# EAGLE design angularclock (EAGLE 6.5.0)
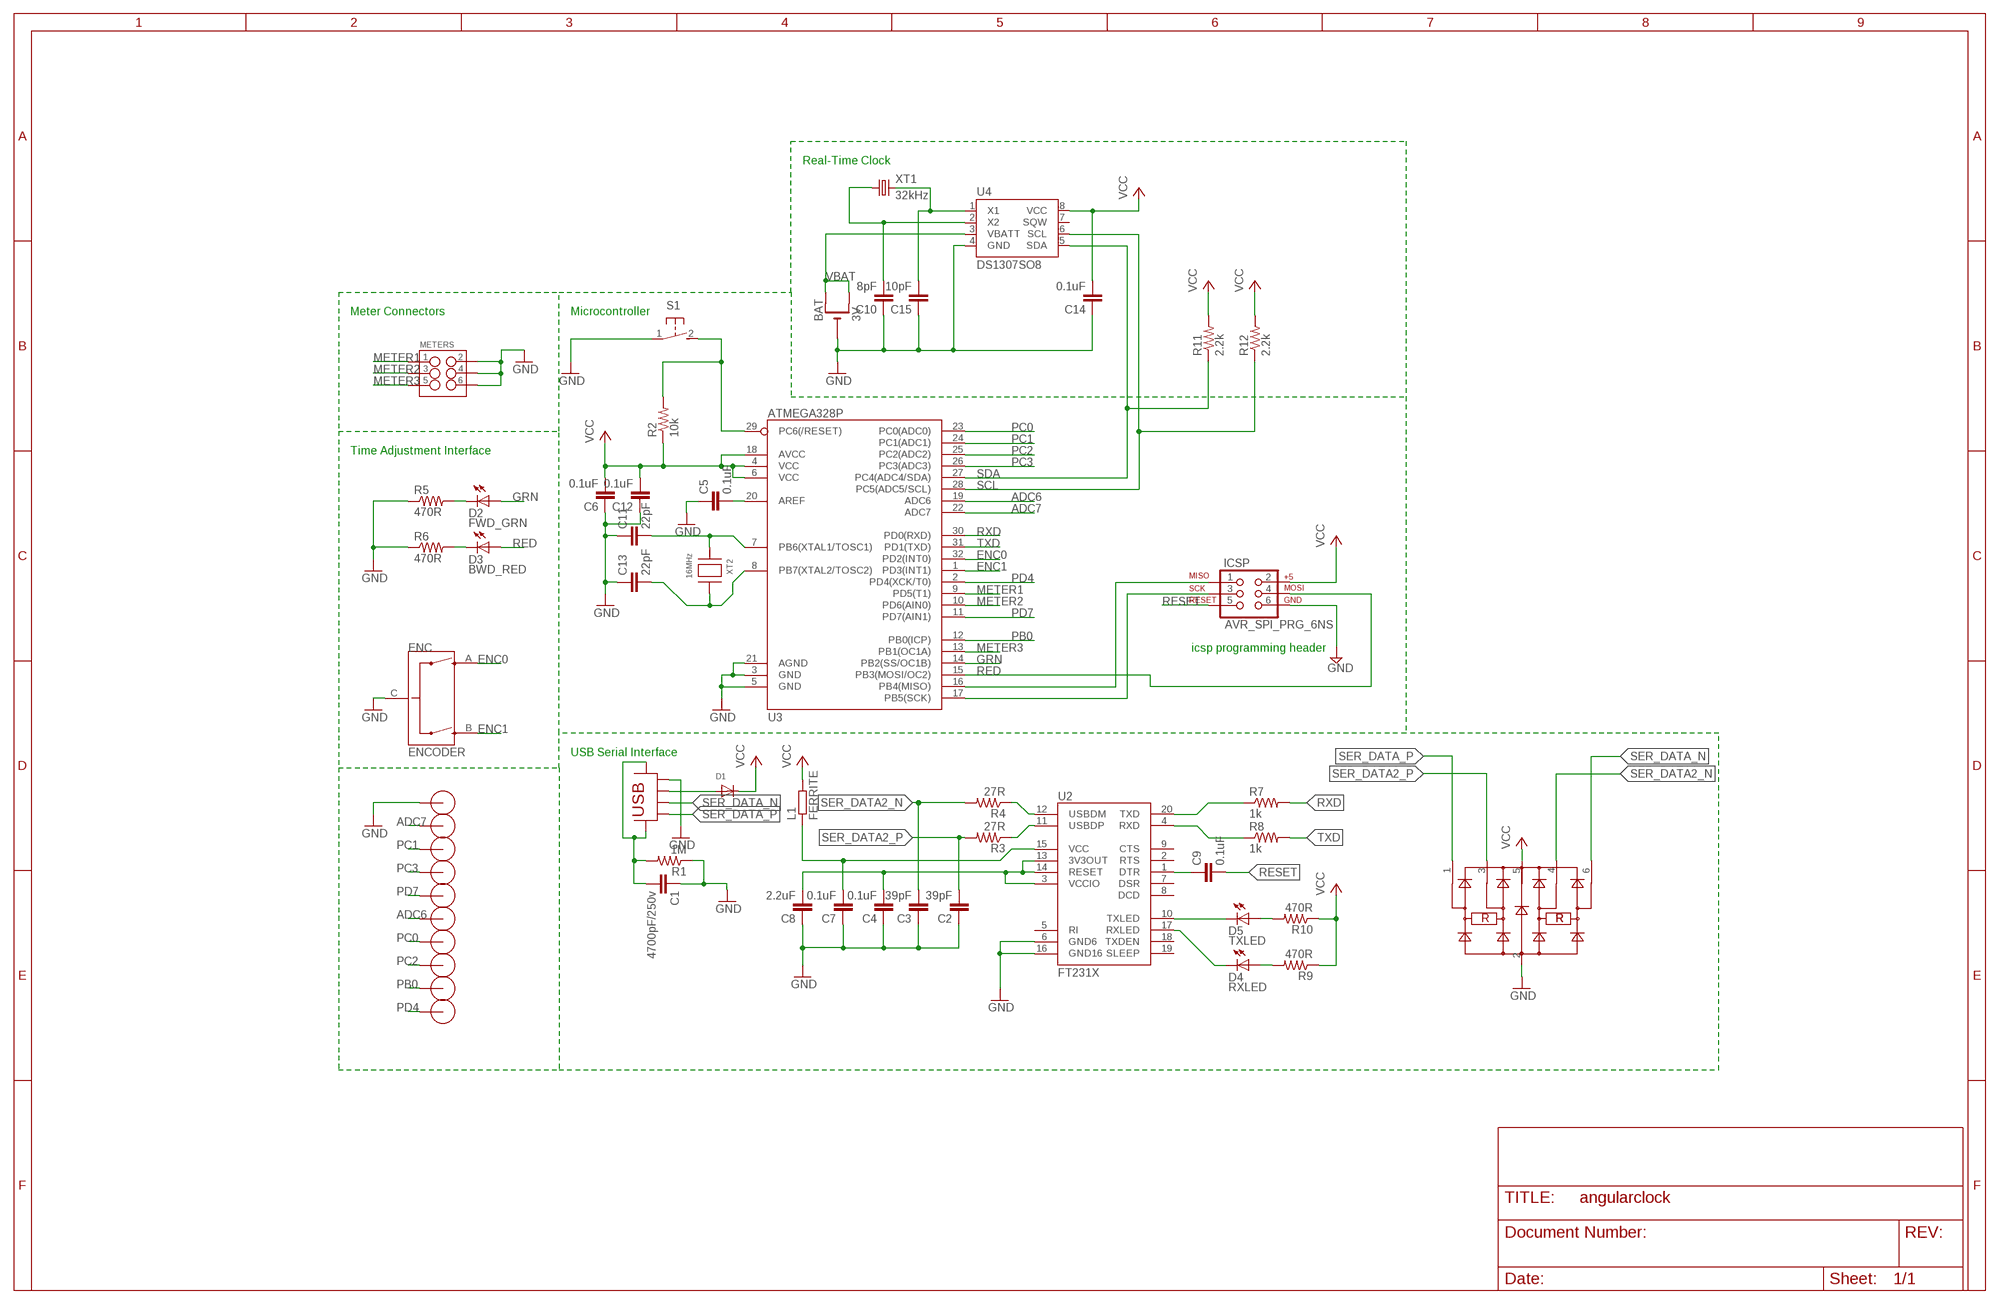
[diagram p0: schematic, sheet 1]

## Parts
BAT  3V  CR1220THM  [CR1220-THM]
C1  4700pF/250v  CAP0805  [0805]
C2  39pF  CAP0805  [0805]
C3  39pF  CAP0805  [0805]
C4  0.1uF  CAP0805  [0805]
C5  0.1uF  CAP0805  [0805]
C6  0.1uF  CAP0805  [0805]
C7  0.1uF  CAP0805  [0805]
C8  2.2uF  CAP0805  [0805]
C9  0.1uF  CAP0805  [0805]
C10  8pF  CAP0805  [0805]
C11  22pF  CAP0805  [0805]
C12  0.1uF  CAP0805  [0805]
C13  22pF  CAP0805  [0805]
C14  0.1uF  CAP0805  [0805]
C15  10pF  CAP0805  [0805]
D1  MBRM130LT1G  [DO-216AA]
D2  FWD_GRN  LEDCHIPLED_0805  [CHIPLED_0805]
D3  BWD_RED  LEDCHIPLED_0805  [CHIPLED_0805]
D4  RXLED  LEDCHIPLED_0805  [CHIPLED_0805]
D5  TXLED  LEDCHIPLED_0805  [CHIPLED_0805]
ENC  ENCODER  ENCODER-QUADRATURE  [ENCODER-16MM-QUAD]
ICSP  AVR_SPI_PRG_6NS  [2X3-NS]
L1  FERRITE  R-EU_R0805  [R0805]
METERS  M03X2NO_SILK  [2X3-NS]
R1  1M  RESISTOR0805-RES  [0805]
R2  10k  RESISTOR0805-RES  [0805]
R3  27R  RESISTOR0805-RES  [0805]
R4  27R  RESISTOR0805-RES  [0805]
R5  470R  RESISTOR0805-RES  [0805]
R6  470R  RESISTOR0805-RES  [0805]
R7  1k  RESISTOR0805-RES  [0805]
R8  1k  RESISTOR0805-RES  [0805]
R9  470R  RESISTOR0805-RES  [0805]
R10  470R  RESISTOR0805-RES  [0805]
R11  2.2k  RESISTOR0805-RES  [0805]
R12  2.2k  RESISTOR0805-RES  [0805]
S1  31-XX  [B3F-31XX]
U1  IP4234CZ6  [SOT457]
U2  FT231X  [SSOP20]
U3  ATMEGA328P  ATMEGA328_SMT  [TQFP32-08]
U4  DS1307SO8  [SO08]
U$1  1PIN  [1PIN]
U$2  1PIN  [1PIN]
U$3  1PIN  [1PIN]
U$4  1PIN  [1PIN]
U$5  1PIN  [1PIN]
U$6  1PIN  [1PIN]
U$7  1PIN  [1PIN]
U$8  1PIN  [1PIN]
U$9  1PIN  [1PIN]
U$10  1PIN  [1PIN]
USB  MICRO-USB-POWERMICRO-USB-2-ROUND-HOLES  WICKED-DEVICE_MICRO-USB-POWERMICRO-USB-4  [WICKED-DEVICE_MICRO-USB-4]
XT1  32kHz  CRYSTAL_CRYSTALTC26V  [CRYSTAL_TC26V]
XT2  16MHz  ABLS  [ABLS]

## Nets
ADC6: U3.19(ADC6) U$1.1
ADC7: U3.22(ADC7) U$4.1
ENC0: ENC.A U3.32(PD2(INT0))
ENC1: ENC.B U3.1(PD3(INT1))
FT33: C4.2 C8.2 U2.3(VCCIO) U2.13(3V3OUT) U2.14(RESET)
FTDI_VCC: C7.2 L1.1 U2.15(VCC)
GND: BAT.- C1.1 C2.1 C3.1 C4.1 C5.1 C6.1 C7.1 C8.1 C10.1 C11.1 C12.1 C13.1 C14.1 C15.1 ENC.C ICSP.6 METERS.2 METERS.4 METERS.6 R1.1 R5.1 R6.1 S1.1(P) U1.2 U2.6(GND6) U2.16(GND16) U3.3(GND) U3.5(GND) U3.21(AGND) U4.4(GND) U$2.1 USB.GND
GRN: D2.A U3.14(PB2(SS/OC1B))
METER1: METERS.1 U3.9(PD5(T1))
METER2: METERS.3 U3.10(PD6(AIN0))
METER3: METERS.5 U3.13(PB1(OC1A))
MISO: ICSP.1 U3.16(PB4(MISO))
N$1: C11.2 U3.7(PB6(XTAL1/TOSC1)) XT2.1
N$2: C5.2 U3.20(AREF)
N$3: D2.C R5.2
N$4: C13.2 U3.8(PB7(XTAL2/TOSC2)) XT2.2
N$5: D3.C R6.2
N$6: R7.1 U2.20(TXD)
N$7: C1.2 R1.2 USB.P$2 USB.P$3
N$8: C15.2 U4.1(X1) XT1.2
N$9: C10.2 U4.2(X2) XT1.1
N$21: R8.1 U2.4(RXD)
N$25: D5.C U2.10(TXLED)
N$26: D4.C U2.17(RXLED)
N$27: D5.A R10.2
N$28: D4.A R9.2
N$30: C9.1 U2.1(DTR)
PB0: U3.12(PB0(ICP)) U$5.1
PC0: U3.23(PC0(ADC0)) U$3.1
PC1: U3.24(PC1(ADC1)) U$6.1
PC2: U3.25(PC2(ADC2)) U$7.1
PC3: U3.26(PC3(ADC3)) U$10.1
PD4: U3.2(PD4(XCK/T0)) U$9.1
PD7: U3.11(PD7(AIN1)) U$8.1
RED: D3.A ICSP.4 U3.15(PB3(MOSI/OC2))
RESET: C9.2 ICSP.5 R2.2 S1.2(S) U3.29(PC6(/RESET))
RXD: R7.2 U3.30(PD0(RXD))
SCK: ICSP.3 U3.17(PB5(SCK))
SCL: R12.1 U3.28(PC5(ADC5/SCL)) U4.6(SCL)
SDA: R11.1 U3.27(PC4(ADC4/SDA)) U4.5(SDA)
SER_DATA2_N [differential_100ohm]: C3.2 R4.2 U1.4
SER_DATA2_P [differential_100ohm]: C2.2 R3.2 U1.3
SER_DATA_N [differential_100ohm]: U1.6 USB.D-
SER_DATA_P [differential_100ohm]: U1.1 USB.D+
TXD: R8.2 U3.31(PD1(TXD))
USB_N [differential_100ohm]: R4.1 U2.12(USBDM)
USB_P [differential_100ohm]: R3.1 U2.11(USBDP)
USB_VCC: D1.+ USB.VBUS
VBAT: BAT.+1(+) BAT.+2(+1) U4.3(VBATT)
VCC: C6.2 C12.2 C14.2 D1.- ICSP.2 L1.2 R2.1 R9.1 R10.1 R11.2 R12.2 U1.5 U3.4(VCC) U3.6(VCC) U3.18(AVCC) U4.8(VCC)
Unconnected: U2.2(RTS) U2.5(RI) U2.7(DSR) U2.8(DCD) U2.9(CTS) U2.18(TXDEN) U2.19(SLEEP) U4.7(SQW)

## Notes on the sheet
- Real-Time Clock
- Meter Connectors | Microcontroller
- Time Adjustment Interface
- icsp programming header
- USB Serial Interface

## Library data of the parts
BAT = adafruit:CR1220: CR1216/CR1220/CR1225 12mm 3V lithium coin cell Great for battery packup. Both SMT and THM holders. Note the THM package has the ground pads on both sides of the PCB so that the masks are the same - this reduces the cost
C1-C15 = SparkFun-Passives:CAP: Capacitor Standard 0603 ceramic capacitor, and 0.1" leaded capacitor.
D1 = wicked-device:MBRM130LT1G
D2-D5 = adafruit:LED: LED OSRAM: - CHIPLED LG R971, LG N971, LY N971, LG Q971, LY Q971, LO R971, LY R971 LH N974, LH R974 LS Q976, LO Q976, LY Q976 LO Q996 - Hyper CHIPLED LW Q18S LB Q993, LB Q99A, LB R99A - SideLED LS A670, LO A670, LY A670, LG A670, LP A670 LB A673, LV A673, LT A673, LW A673 LH A674 LY A675 LS A676, LA A676, LO A676, LY A676, LW A676 LS A679, LY A679, LG A679 - Hyper Micro SIDELED® LS Y876, LA Y876, LO Y876, LY Y876 LT Y87S - SmartLED LW L88C, LW L88S LB L89C, LB L89S, LG L890 LS L89K, LO L89K, LY L89K LS L896, LA L896, LO L896, LY L896 - TOPLED LS T670, LO T670, LY T670, LG T670, LP T670 LSG T670, LSP T670, LSY T670, LOP T670, LYG T670 LG T671, LOG T671, LSG T671 LB T673, LV T673, LT T673, LW T673 LH T674 LS T676, LA T676, LO T676, LY T676, LB T676, LH T676, LSB T676, LW T676 LB T67C, LV T67C, LT T67C, LS T67K, LO T67K, LY T67K, LW E67C LS E67B, LA E67B, LO E67B, LY E67B, LB E67C, LV E67C, LT E67C LW T67C LS T679, LY T679, LG T679 LS T770, LO T770, LY T770, LG T770, LP T770 LB T773, LV T773, LT T773, LW T773 LH T774 LS E675, LA E675, LY E675, LS T675 LS T776, LA T776, LO T776, LY T776, LB T776 LHGB T686 LT T68C, LB T68C - Hyper Mini TOPLED® LB M676 - Mini TOPLED Santana® LG M470 LS M47K, LO M47K, LY M47K Source: http://www.osram.convergy.de/
ENC = SparkFun-Electromechanical:ENCODER-QUADRATURE: quadrature encoder from Top-Up, part#EC16PHBF-B-20F-24-24C-16Y
ICSP = SparkFun:AVR_SPI_PRG_6: AVR ISP 6 Pin This is the reduced ISP connector for AVR programming. Common on Arduino. This footprint will take up less PCB space and can be used with a 10-pin to 6-pin adapter such as SKU: BOB-08508
L1 = rcl:R-EU_: RESISTOR, European symbol
METERS = SparkFun-Connectors:M03X2: 2x3 .1" header. Shrouded, with keying- CONN-10681 SMT- CONN-11415 Pogo pins- HW-11044
R1-R12 = SparkFun-Passives:RESISTOR: Resistor Basic schematic elements and footprints for 0603, 1206, and PTH resistors.
S1 = switch-omron:31-XX: OMRON SWITCH
U1 = wicked-device:IP4234CZ6
U2 = iofault:FT231X: USB UART FT232RL 4th Generation USB UART (USB <-> Serial) Controller. Spark Fun Electronics SKU : COM-00650
U3 = SparkFun-DigitalIC:ATMEGA328_SMT: 32-Pin Atmega328 part Commonly used on Arduino compatible boards Available in QFP and QFN packages TQFP is IC-09069 QFN is non-stock; PROD_ID: IC-09069
U4 = SparkFun:DS1307
U$1-U$10 = wicked-device:1PIN
USB = nanodeRF_11:WICKED-DEVICE_MICRO-USB-POWER
XT1 = nanodeRF_11:CRYSTAL_CRYSTAL: CRYSTAL
XT2 = wicked-device:ABLS

## Net classes
1 power: width 0.4 mm
2 differential_100ohm: width 0.254 mm, clearance 0.152 mm

## Board
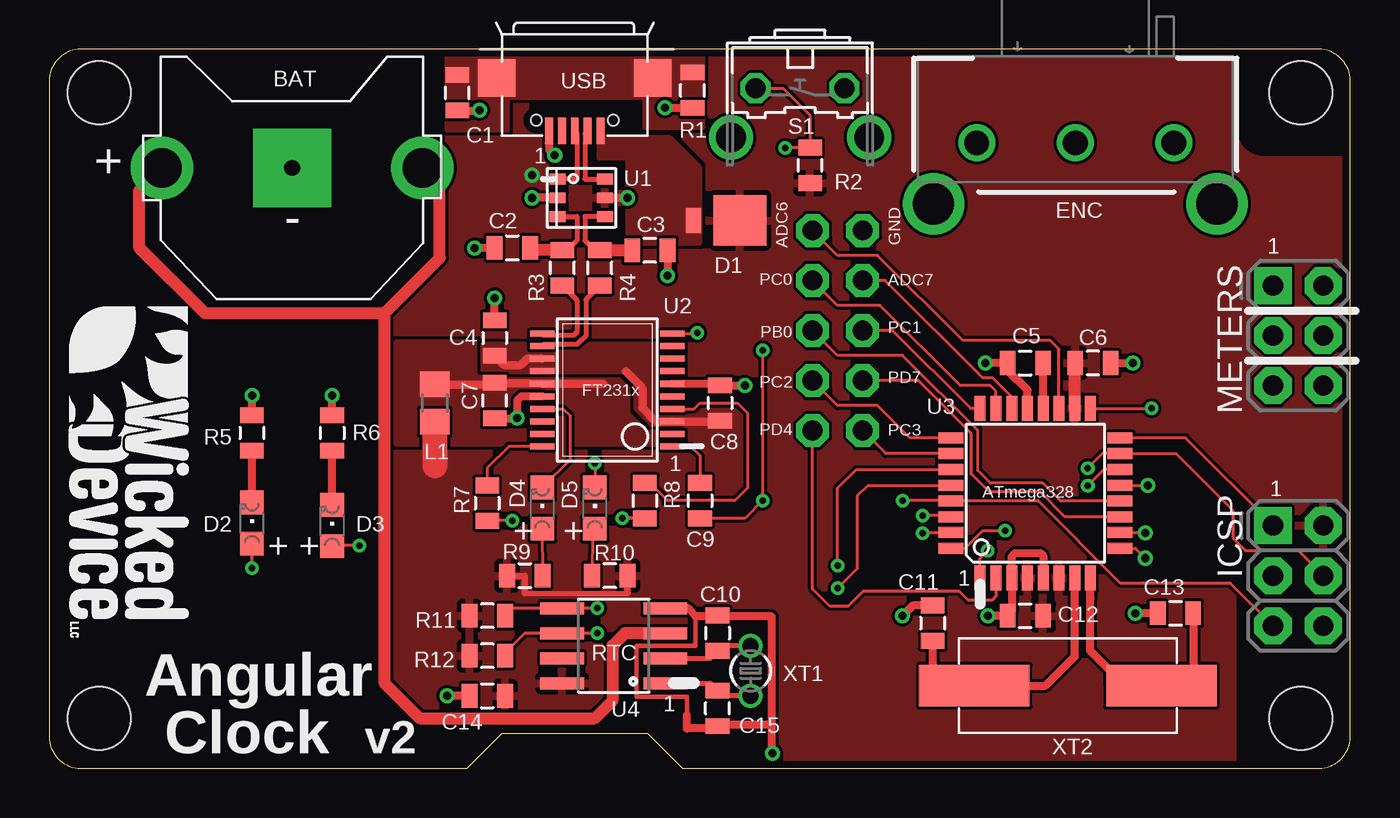
[diagram p1: board, top side]
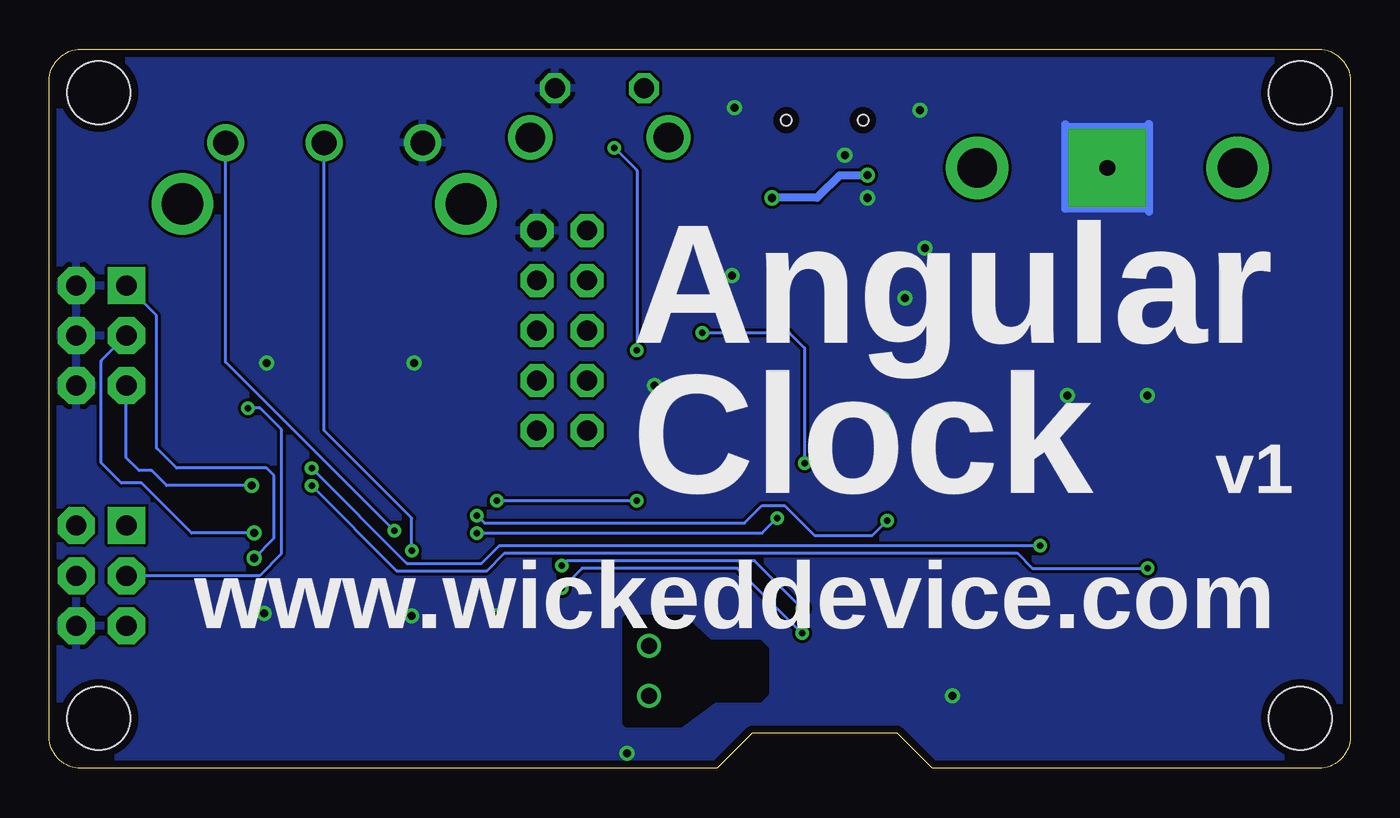
[diagram p2: board, bottom side, seen from below]

Size 66.02 x 36.5 mm. Coordinates in mm from the lower left corner, seen from the top.
Outline: 0,34.9 0,1.6 arc90 1.6,0 21.21,0 22.99,1.78 30.35,1.78 32.13,0 64.42,0 arc90 66.02,1.6 66.02,34.9 arc90 64.42,36.5 1.6,36.5 arc90 0,34.9
Copper layers (1*16): Top 0.0356mm / dielectric 1.5011mm / Bottom 0.0356mm
Design rules "default": minimum track width 6mil, minimum drill 13mil, track to track 6mil, track to pad 6mil, pad to pad 6mil, via to via 6mil, smd to smd 6mil, copper to edge 15mil, drill to drill 6mil, minimum pad ring 7mil, minimum via ring 7mil, stop-mask expansion 4mil, vias tented up to drill 20mil, thermal gap 10mil
Holes 3.2 mm at 2.54,34.29 63.5,34.29 63.5,2.54 2.54,2.54
tRestrict: 7 lines
bRestrict: area 29.8,2.3 to 36.7,7.5

### Footprints (pad centres in the part's own frame; a part is rotated, then mirrored left to right if it is on the bottom)
CR1220-THM = drill 2 pad 3.175: +1 -6.604,0; +2 6.604,0 | drill 0.8 pad 3.962 square: - 0,0
0805 = smd 0.8 x 1.2: 1 -0.9,0; 2 0.9,0
DO-216AA = smd 0.762 x 1.27: + 0.699,0 | smd 2.667 x 2.54: - -1.651,0
CHIPLED_0805 = smd 1.2 x 1.2: A 0,-1.05; C 0,1.05
ENCODER-16MM-QUAD = drill 1.25: A 0,-5; B 0,0; C 0,5 | drill 2.1: P$1 -3.1,7.2; P$2 -3.1,-7.2
2X3-NS = drill 1.016 pad 1.88 square: 1 -2.54,-1.27 | drill 1.016 pad 1.88 octagon: 2 -2.54,1.27; 3 0,-1.27; 4 0,1.27; 5 2.54,-1.27; 6 2.54,1.27
R0805 = smd 1.3 x 1.5: 1 -0.95,0; 2 0.95,0
B3F-31XX = drill 1.016 octagon: 1 -2.261,-1.245; 2 2.261,-1.245 | drill 1.499 pad 2.159: 3 -3.505,1.245; 4 3.505,1.245
SOT457 = smd 0.8 x 0.55: 1 -1.2,0.95; 2 -1.2,0; 3 -1.2,-0.95; 4 1.2,-0.95; 5 1.2,0; 6 1.2,0.95
SSOP20 = smd 0.305 x 1.245: 1 -2.857,-3.302; 2 -2.222,-3.302; 3 -1.587,-3.302; 4 -0.952,-3.302; 5 -0.317,-3.302; 6 0.318,-3.302; 7 0.953,-3.302; 8 1.588,-3.302; 9 2.223,-3.302; 10 2.858,-3.302; 11 2.858,3.302; 12 2.223,3.302; 13 1.588,3.302; 14 0.953,3.302; 15 0.318,3.302; 16 -0.317,3.302; 17 -0.952,3.302; 18 -1.587,3.302; 19 -2.222,3.302; 20 -2.857,3.302
TQFP32-08 = smd 1.27 x 0.559: 1 -4.293,2.8; 2 -4.293,2; 3 -4.293,1.2; 4 -4.293,0.4; 5 -4.293,-0.4; 6 -4.293,-1.2; 7 -4.293,-2; 8 -4.293,-2.8; 17 4.293,-2.8; 18 4.293,-2; 19 4.293,-1.2; 20 4.293,-0.4; 21 4.293,0.4; 22 4.293,1.2; 23 4.293,2; 24 4.293,2.8 | smd 0.559 x 1.27: 9 -2.8,-4.293; 10 -2,-4.293; 11 -1.2,-4.293; 12 -0.4,-4.293; 13 0.4,-4.293; 14 1.2,-4.293; 15 2,-4.293; 16 2.8,-4.293; 25 2.8,4.293; 26 2,4.293; 27 1.2,4.293; 28 0.4,4.293; 29 -0.4,4.293; 30 -1.2,4.293; 31 -2,4.293; 32 -2.8,4.293
SO08 = smd 0.61 x 2.21: 1 -1.905,-2.616; 2 -0.635,-2.616; 3 0.635,-2.616; 4 1.905,-2.616; 5 1.905,2.616; 6 0.635,2.616; 7 -0.635,2.616; 8 -1.905,2.616
1PIN = drill 1 pad 1.676 octagon: 1 0,0
WICKED-DEVICE_MICRO-USB-4 = smd 0.4 x 1.35: D+ 0,2.7; D- -0.65,2.7; GND 1.3,2.7; ID 0.65,2.7; VBUS -1.3,2.7 | smd 1.9 x 1.9: P$2 -3.95,0; P$3 3.95,0 | hole 0.55: -1.95,2.15; 1.95,2.15
CRYSTAL_TC26V = drill 0.813: 1 -1.27,0; 2 1.27,0
ABLS = smd 5.6 x 2.1: 1 -4.75,0; 2 4.75,0

### Placement (x,y rotation side)
BAT  12.32,30.48 0 top
C1  20.7,34.29 90 top
C2  23.5,26.42 0 top
C3  30.48,26.29 180 top
C4  22.61,21.84 270 top
C5  49.53,20.57 0 top
C6  52.96,20.57 180 top
C7  22.61,18.67 90 top
C8  34.04,18.54 270 top
C9  33.02,13.59 270 top
C10  33.91,6.86 270 top
C11  44.83,7.37 270 top
C12  49.53,7.75 0 top
C13  57.15,7.87 0 top
C14  22.23,3.68 0 top
C15  33.91,3.05 90 top
D1  33.4,27.81 180 top
D2  10.29,12.45 0 top
D3  14.35,12.32 0 top
D4  25.02,13.21 0 top
D5  27.69,13.21 0 top
ENC  52.07,31.75 90 top
ICSP  63.37,9.78 270 top
L1  19.56,18.54 270 top
METERS  63.37,21.96 270 top
R1  32.64,34.42 90 top
R2  38.61,30.61 90 top
R3  26.04,25.4 90 top
R4  27.94,25.4 90 top
R5  10.29,17.02 270 top
R6  14.35,17.02 270 top
R7  22.23,13.46 270 top
R8  30.23,13.59 270 top
R9  24.13,9.78 0 top
R10  28.45,9.78 180 top
R11  22.23,7.75 180 top
R12  22.23,5.71 180 top
S1  38.1,33.27 180 top
U1  27,28.96 0 top
U2  28.32,19.2 90 top
U3  50.04,13.97 90 top
U4  28.64,6.22 90 top
U$1  38.73,27.3 0 top
U$2  41.27,27.3 0 top
U$3  38.73,24.77 0 top
U$4  41.27,24.77 0 top
U$5  38.73,22.23 0 top
U$6  41.27,22.23 0 top
U$7  38.73,19.68 0 top
U$8  41.27,19.68 0 top
U$9  38.73,17.14 0 top
U$10  41.27,17.14 0 top
U$11  [WICKEDLOGOTYPE]  0.25,23.75 270 top
USB  26.67,35.05 180 top
XT1  35.59,4.95 270 top
XT2  51.69,4.19 0 top

### Tracks (layer width: path | path; a pad name or v marks a point on that pad's centre or on a via)
ADC6
  Top 0.152: U3.19 51.24,21.28 50.8,21.72 46.35,21.72 42.04,26.04 40.01,26.04 U$1.1
ADC7
  Top 0.152: U3.22 48.84,18.85 47.88,19.81 47.37,19.81 42.42,24.77 U$4.1
ENC0  (via drill 0.33)
  Top 0.152: U3.32 46.48,11.17 47.37,12.06 v48.51,12.06
  Bottom 0.152: v48.51,12.06 57.07,20.62 ENC.A
ENC1  (via drill 0.33)
  Top 0.152: U3.1 47.24,10.66 v47.62,11.05
  Bottom 0.152: v47.62,11.05 47.62,12.7 52.07,17.14 ENC.B
FT33
  Top 0.406: U2.13 24.27,20.79 23.95,20.47 23.08,20.47 C4.2 | C8.2 34.04,17.61 U2.3 30.77,17.61 30.1,18.29 30.1,19.3 29.25,20.16
  pour Top (rank 3, no thermals): 22.1,21.46 35.31,21.46 35.31,13.72 32.38,13.72 32.38,17.53 30.61,17.53 29.84,18.29 29.84,19.56 29.21,20.19 22.1,20.19
FTDI_VCC
  Top 0.406: 28.11,19.52 U2.15 22.61,19.52 C7.2 22.53,19.49 L1.1
  pour Top (isolate 0.152, rank 4, no thermals): 17.65,16.51 17.65,21.59 33.02,21.59 33.02,17.78 35.56,17.78 35.56,13.97 31.75,13.97 31.75,16.51
GND  (via drill 0.41)
  Top 0.229: 32.8,7.71 32.8,6.21 29.79,6.21 29.79,3.62 32.36,3.62 32.36,2.71
  Top 0.305: 32.36,2.68 32.38,2.71
  Top 0.4: 31.27,8.12 U4.4 | 34.02,2.2 33.95,2.12 33.85,2.02
  Top 0.406: 33.85,2.02 32.36,2.02 32.36,2.68 32.36,2.71 | 31.27,8.12 32.46,8.12 32.8,7.71 33.77,7.71 33.82,7.76 C10.1 33.91,7.71 36.66,7.71 36.66,2.2 | C1.1 v21.83,33.39 v21.84,33.4 | C2.1 v21.59,26.42 | USB.GND 25.37,31.4 v25.65,31.11 | C3.1 v31.38,25.03 v31.37,25.02 | R1.1 31.25,33.52 v31.24,33.53 | U2.6 33.96,19.52 C8.1 35.3,19.44 v35.31,19.43 | C14.1 v20.19,3.68 | C11.1 43.83,8.27 v43.31,7.75 | U3.5 50.44,10.78 50.29,10.92 49.02,10.92 48.84,10.74 U3.3 48.84,7.96 C12.1 v47.62,7.75 | C13.1 v55.12,7.87 | v47.5,20.57 C5.1 48.63,20.2 49.64,19.2 U3.21 | C6.1 v54.99,20.57 | C4.1 v22.61,23.88 | R6.1 v14.35,18.92 | R5.1 v10.29,18.92 | U1.2 v24.51,28.96 | C15.1 33.95,2.12 | 36.66,2.2 33.91,2.2 | v36.7,0.76 36.66,0.8 36.66,2.2 | U2.16 23.96,18.89 23.75,18.67 v23.75,17.78 23.75,17.77 C7.1
  Bottom 0.406: 10.21,28.26 10.21,32.7 10.24,32.7 10.24,32.63 10.2,32.59 10.2,32.58 14.35,32.58 14.45,32.68 14.46,32.68 14.46,28.41 10.27,28.41 10.27,28.43 BAT.- | 10.26,32.49 12.31,30.44 12.32,30.44 BAT.- | 14.39,32.5 12.34,30.45 12.32,30.45 BAT.- | 14.38,28.47 12.33,30.52 12.32,30.52 BAT.-
  pour Bottom (isolate 0.152): -2.54,39.37 -2.54,-2.54 69.85,-2.54 69.85,39.37
GRN  (via drill 0.33)
  Top 0.152: U3.14 53.52,15.17 v52.7,14.35 | v10.29,10.16 D2.A
  Bottom 0.152: v52.7,14.35 48.39,10.03 43.81,10.03 42.93,10.92 16.89,10.92 16.13,10.16 v10.29,10.16
METER1  (via drill 0.41)
  Top 0.152: U3.9 55.12,11.17 v55.63,10.67
  Bottom 0.152: v55.63,10.67 54.61,11.68 54.61,14.86 54.99,15.24 59.56,15.24 60.58,16.26 60.58,22.98 METERS.1
METER2  (via drill 0.41)
  Top 0.152: U3.10 55.59,11.97 v55.63,11.94
  Bottom 0.152: v55.63,11.94 58.8,11.94 61.34,14.48 62.36,14.48 63.37,15.49 63.37,20.69 METERS.3
METER3  (via drill 0.41)
  Top 0.152: U3.13 54.33,14.35 v55.75,14.35
  Bottom 0.152: v55.75,14.35 60.07,14.35 60.83,15.11 61.47,15.11 62.1,15.75 METERS.5
MISO
  Top 0.152: ICSP.1 57.65,16.77 U3.16
N$1
  Top 0.406: C11.2 44.83,4.19 XT2.1 50.55,4.19 52.04,5.68 U3.7
N$2
  Top 0.406: U3.20 C5.2
N$3
  Top 0.406: D2.C R5.2
N$4
  Top 0.406: U3.8 52.84,8.64 52.83,8.64 52.83,5.97 53.85,4.95 53.85,4.19 XT2.2 58.05,4.19 C13.2
N$5
  Top 0.406: D3.C R6.2
N$6
  Top 0.152: U2.20 23.33,16.34 22.23,15.24 R7.1
N$7
  pour Top (isolate 0.152, no thermals): 23.24,32.38 20.19,32.38 20.19,36.45 33.15,36.58 33.15,32.51 30.23,32.51 30.23,34.04 23.24,34.04
N$8
  Top 0.254: U4.1 33.54,4.32 C15.2 34.17,3.68 XT1.2
N$9
  Top 0.254: U4.2 33.54,5.59 C10.2 34.17,6.22 XT1.1
N$21
  Top 0.152: U2.4 32.73,18.25 33.02,18.54 34.92,18.54 35.43,18.03 35.43,14.22 34.8,13.59 31.37,13.59 30.73,14.22 30.49,14.22 R8.1
N$25  (via drill 0.33)
  Top 0.152: U2.10 32.85,22.06 v32.89,22.1 | v27.69,15.49 D5.C
  Bottom 0.152: v27.69,15.49 27.69,21.34 28.45,22.1 v32.89,22.1
N$26
  Top 0.152: U2.17 26.07,18.25 26.42,17.91 26.42,15.65 D4.C
N$27
  Top 0.152: D5.A 27.56,12.03 R10.2
N$28
  Top 0.152: D4.A R9.2
N$30
  Top 0.152: U2.1 32.55,16.34 33.02,15.88 C9.1
PB0
  Top 0.152: U3.12 51.33,13.57 50.42,14.48 47.75,14.48 47.12,15.11 47.12,17.14 43.31,20.95 40.01,20.95 U$5.1
PC0
  Top 0.152: U3.23 48.04,19.14 47.75,19.43 46.23,19.43 42.16,23.5 40.01,23.5 U$3.1
PC1
  Top 0.152: U3.24 46.76,18.26 42.8,22.23 U$6.1
PC2
  Top 0.152: U3.25 43.68,16.77 42.04,18.41 40.01,18.41 U$7.1
PC3
  Top 0.152: U3.26 42.45,15.97 U$10.1
PD4
  Top 0.152: U3.2 48.04,8.72 47.85,8.53 46.63,8.53 46.18,8.99 41.3,8.99 40.54,8.23 39.62,8.23 38.73,9.12 U$9.1
PD7
  Top 0.152: U3.11 51.54,12.77 50.29,14.02 47.7,14.02 46.79,14.94 46.79,16.99 44.09,19.68 U$8.1
RED  (via drill 0.33)
  Top 0.152: ICSP.4 63.37,11.05 60.71,11.05 60.07,11.68 60.07,13.08 57.18,15.97 U3.15 53.44,15.97 v52.7,15.24 | v15.75,11.3 14.38,11.3 D3.A
  Bottom 0.152: v52.7,15.24 47.88,10.41 44.07,10.41 43.18,11.3 v15.75,11.3
RESET  (via drill 0.33)
  Top 0.152: v37.34,31.5 38.62,31.5 R2.2 38.61,33.15 37.24,34.52 S1.2 | v43.31,13.59 45.76,13.59 U3.29 50.18,13.57 54.36,9.4 59.94,9.4 ICSP.5 | C9.2 35.3,12.69 v36.2,13.59 v36.2,21.21
  Top 0.203: C9.2
  Bottom 0.152: v37.34,31.5 36.2,30.35 v36.2,21.21 | v43.31,13.59 v36.2,13.59
RXD  (via drill 0.33)
  Top 0.152: U3.30 45.69,12.83 v44.32,12.83 | v23.5,12.57 22.24,12.57 R7.2
  Bottom 0.152: v44.32,12.83 43.94,12.45 30.73,12.45 29.84,13.34 28.7,13.34 27.18,11.81 24.26,11.81 v23.5,12.57
SCK  (via drill 0.33)
  Top 0.152: U3.17 55.91,18.26 v55.93,18.29
  Bottom 0.152: ICSP.3 55.35,9.78 54.25,10.87 54.25,17.22 55.32,18.29 v55.93,18.29
SCL  (via drill 0.33)
  Top 0.152: v27.81,6.86 U4.6 24.13,6.86 23.12,5.85 R12.1 | U3.28 41.55,14.37 41.02,13.84 41.02,10.16 v40.01,9.14
  Bottom 0.152: v40.01,9.14 38.99,10.16 31.11,10.16 v27.81,6.86
SDA  (via drill 0.33)
  Top 0.152: v27.81,8.13 U4.5 23.51,8.13 R11.1 | v40.01,10.29 40.01,14.22 40.95,15.17 U3.27
  Bottom 0.152: v40.01,10.29 39.75,10.54 30.23,10.54 v27.81,8.13
SER_DATA2_N
  Top 0.254: U1.4 27.18,28.01 27.18,26.8 27.68,26.3 R4.2
  Top 0.61: R4.2 29.57,26.3 C3.2
SER_DATA2_P
  Top 0.254: U1.3 26.77,28.01 26.77,26.8 26.27,26.3 R3.2
  Top 0.61: R3.2 24.51,26.3 C2.2
SER_DATA_N
  Top 0.254: USB.D- 27.18,32.21 27.18,29.92 27.19,29.91 U1.6
SER_DATA_P
  Top 0.254: USB.D+ 26.77,32.25 26.77,29.92 26.76,29.91 U1.1
TXD  (via drill 0.33)
  Top 0.152: U3.31 45.71,11.94 v44.32,11.94
  Top 0.203: R8.2 v29.08,12.7
  Bottom 0.152: v44.32,11.94 29.84,11.94 v29.08,12.7
USB_N
  Top 0.254: R4.1 27.23,23.79 27.23,21.95 26.79,21.51 25.11,21.51 U2.12
USB_P
  Top 0.254: R3.1 26.77,23.76 26.77,22.14 26.6,21.97 25.11,21.97 U2.11
USB_VCC
  pour Top (isolate 0.152, rank 2, no thermals): 27.89,32 27.89,30.99 29.34,30.99 29.34,26.67 33.02,26.67 33.02,30.48 31.5,32
VBAT
  Top 0.61: 17.02,23.11 17.02,4.32 18.8,2.54 27.69,2.54 28.57,3.43 28.57,6.22 29.21,6.86 U4.3 | 17.02,23.11 19.81,25.91 19.81,29.59 BAT.+2 | 17.02,23.11 7.87,23.11 4.57,26.42 4.57,29.34 BAT.+1
VCC  (via drill 0.41)
  Top 0.152: 23.38,3.94 C14.2
  Top 0.254: 24.13,8.89 29.35,8.89
  Top 0.305: R9.1 24.13,9.78 24.13,8.89 | 29.35,8.89 R10.1
  Top 0.406: 52.04,20.57 C6.2 | U1.5 v29.34,28.96
  Top 0.61: U3.18 52.04,20.57
  Top 1.27: L1.2 19.56,15.37
  Bottom 0.406: v24.51,30.1 25.91,30.1 27.05,28.96 v29.34,28.96
  pour Top (isolate 0.152, rank 5): 5.59,30.35 -2.54,30.35 -2.54,6.35 4.75,6.35 arc-90 6.35,4.75 6.35,-2.54 60.07,-2.54 60.07,11.3 69.85,11.3 69.85,30.86 61.67,30.86 arc-90 60.07,32.46 60.07,39.37 5.59,39.37

### Text on the board
tPlace: BAT | 1 | + | - | GND | ADC6 | 1 | PC0 | ADC7 | PB0 | PC1 | FT231x | PC2 | PD7 | PD4 | PC3 | 1 | ATmega328 | 1 | + | + | + | + | 1 | RTC | Angular | 1 | Clock | v2
bPlace: Angular | v1 | Clock | www.wickeddevice.com